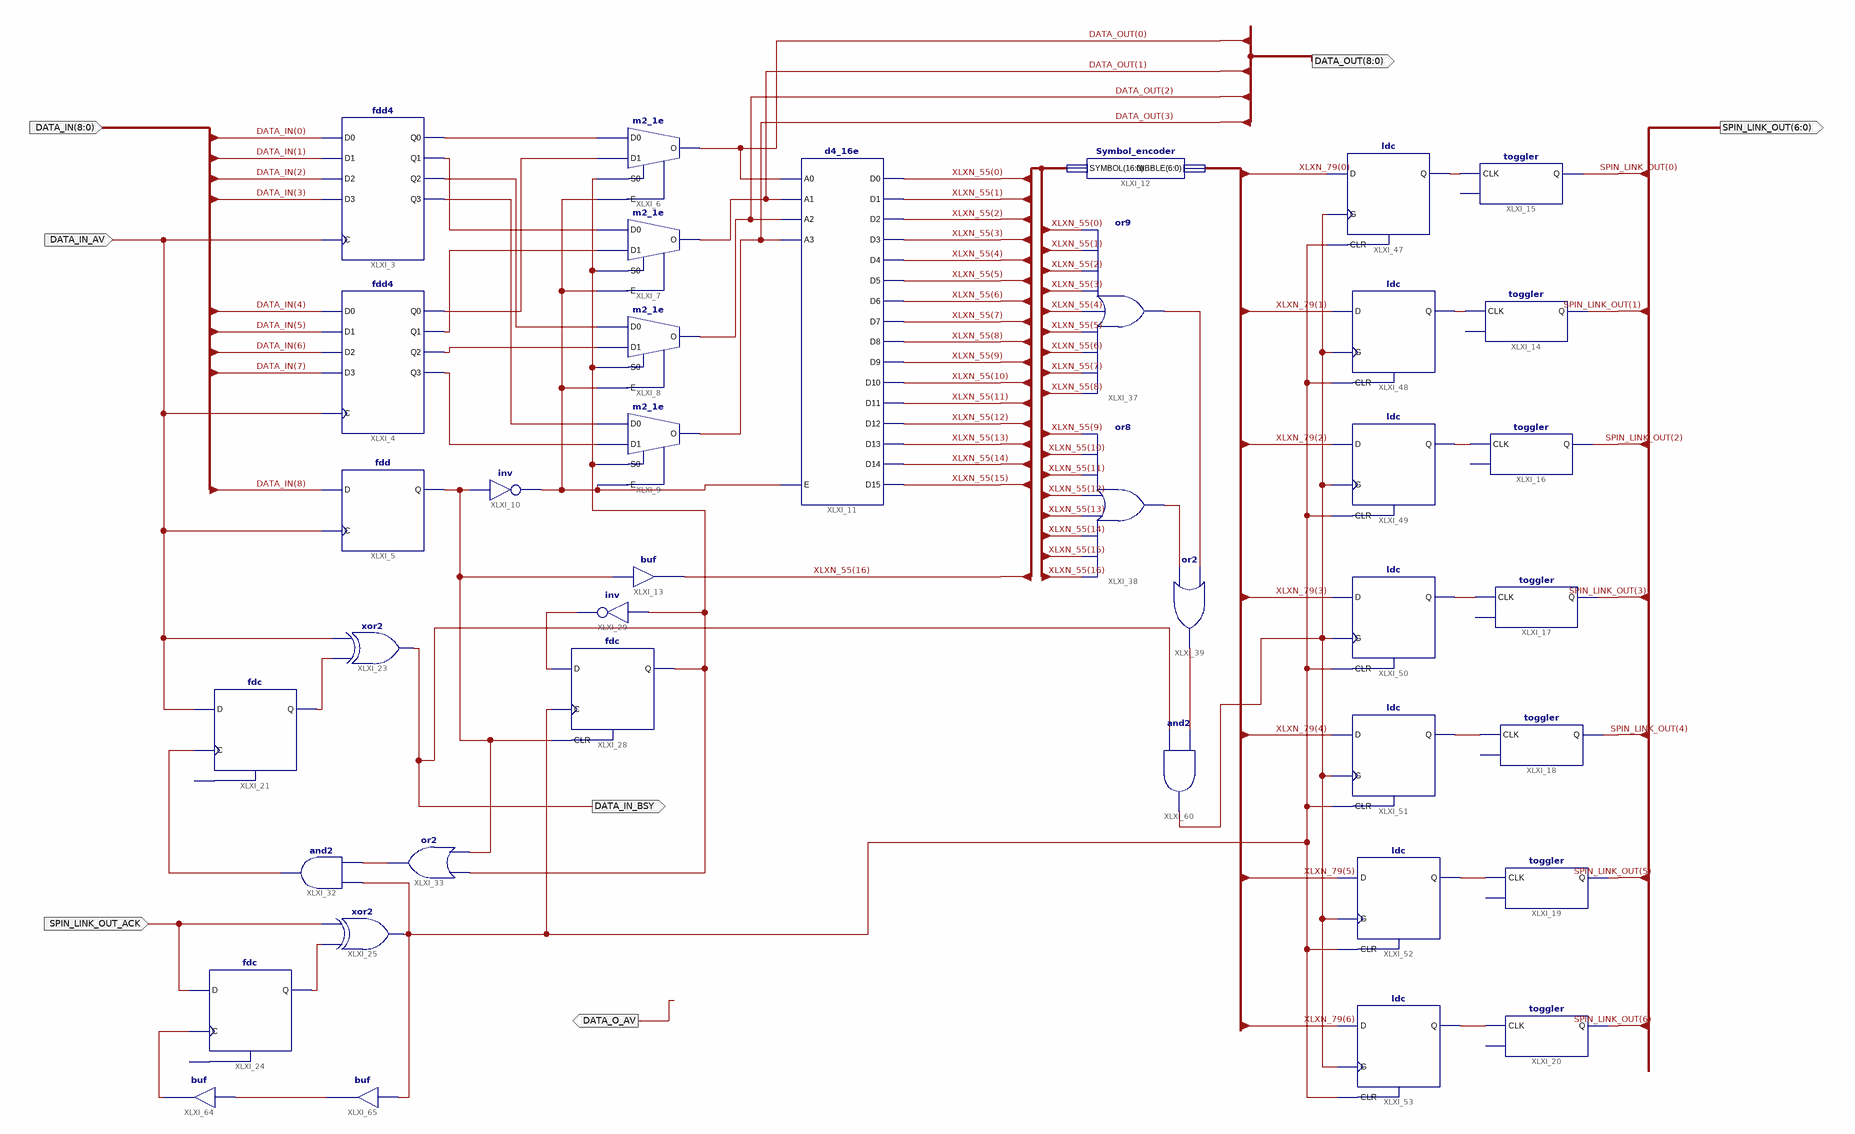
[diagram p0: schematic sheet 1]
// Xilinx ISE schematic Spin_link_output.sch (xbr) as structural Verilog: 39 symbols, 7 ports
module Spin_link_output (
  input  [8:0] DATA_IN,
  input  DATA_IN_AV,
  input  SPIN_LINK_OUT_ACK,
  output DATA_IN_BSY,
  output [6:0] SPIN_LINK_OUT,
  output DATA_O_AV,
  output [8:0] DATA_OUT
);

  wire XLXN_27, XLXN_28, XLXN_29, XLXN_30, XLXN_31, XLXN_32, XLXN_33, XLXN_34, XLXN_43, XLXN_56, XLXN_104,
       XLXN_118, XLXN_148, XLXN_161, XLXN_183, XLXN_184, XLXN_200, XLXN_203, XLXN_228, XLXN_229, XLXN_230,
       XLXN_231, XLXN_232, XLXN_233, XLXN_234, XLXN_258, XLXN_268, XLXN_289, XLXN_290, XLXN_298;
  wire [6:0] XLXN_79;
  wire [16:0] XLXN_55;

  fdd4 XLXI_3 (
    .C(DATA_IN_AV), .D0(DATA_IN[0]), .D1(DATA_IN[1]), .D2(DATA_IN[2]), .D3(DATA_IN[3]), .Q0(XLXN_27),
    .Q1(XLXN_29), .Q2(XLXN_31), .Q3(XLXN_33));
  fdd4 XLXI_4 (
    .C(DATA_IN_AV), .D0(DATA_IN[4]), .D1(DATA_IN[5]), .D2(DATA_IN[6]), .D3(DATA_IN[7]), .Q0(XLXN_28),
    .Q1(XLXN_30), .Q2(XLXN_32), .Q3(XLXN_34));
  fdd XLXI_5 (.C(DATA_IN_AV), .D(DATA_IN[8]), .Q(XLXN_56));
  m2_1e XLXI_6 (.D0(XLXN_27), .D1(XLXN_28), .E(XLXN_43), .S0(XLXN_200), .O(DATA_OUT[0]));
  m2_1e XLXI_7 (.D0(XLXN_29), .D1(XLXN_30), .E(XLXN_43), .S0(XLXN_200), .O(DATA_OUT[1]));
  m2_1e XLXI_8 (.D0(XLXN_31), .D1(XLXN_32), .E(XLXN_43), .S0(XLXN_200), .O(DATA_OUT[2]));
  m2_1e XLXI_9 (.D0(XLXN_33), .D1(XLXN_34), .E(XLXN_43), .S0(XLXN_200), .O(DATA_OUT[3]));
  not XLXI_10 (XLXN_43, XLXN_56);
  d4_16e XLXI_11 (
    .A0(DATA_OUT[0]), .A1(DATA_OUT[1]), .A2(DATA_OUT[2]), .A3(DATA_OUT[3]), .E(XLXN_43), .D0(XLXN_55[0]),
    .D1(XLXN_55[1]), .D10(XLXN_55[10]), .D11(XLXN_55[11]), .D12(XLXN_55[12]), .D13(XLXN_55[13]),
    .D14(XLXN_55[14]), .D15(XLXN_55[15]), .D2(XLXN_55[2]), .D3(XLXN_55[3]), .D4(XLXN_55[4]), .D5(XLXN_55[5]),
    .D6(XLXN_55[6]), .D7(XLXN_55[7]), .D8(XLXN_55[8]), .D9(XLXN_55[9]));
  Symbol_encoder XLXI_12 (.SYMBOL(XLXN_55), .NIBBLE(XLXN_79));
  buf XLXI_13 (XLXN_55[16], XLXN_56);
  fdc XLXI_21 (.C(XLXN_203), .D(DATA_IN_AV), .Q(XLXN_104));  // open: CLR
  xor XLXI_23 (DATA_IN_BSY, XLXN_104, DATA_IN_AV);
  fdc XLXI_28 (.C(XLXN_290), .CLR(XLXN_56), .D(XLXN_148), .Q(XLXN_200));
  not XLXI_29 (XLXN_148, XLXN_200);
  fdc XLXI_24 (.C(XLXN_298), .D(SPIN_LINK_OUT_ACK), .Q(XLXN_118));  // open: CLR
  xor XLXI_25 (XLXN_290, XLXN_118, SPIN_LINK_OUT_ACK);
  or XLXI_37 (XLXN_184, XLXN_55[8], XLXN_55[7], XLXN_55[6], XLXN_55[5], XLXN_55[4], XLXN_55[3], XLXN_55[2], XLXN_55[1], XLXN_55[0]);
  or XLXI_38 (XLXN_183, XLXN_55[16], XLXN_55[15], XLXN_55[14], XLXN_55[13], XLXN_55[12], XLXN_55[11], XLXN_55[10], XLXN_55[9]);
  or XLXI_39 (XLXN_258, XLXN_183, XLXN_184);
  toggler XLXI_14 (.CLK(XLXN_229), .Q(SPIN_LINK_OUT[1]));  // open: CLR
  toggler XLXI_15 (.CLK(XLXN_228), .Q(SPIN_LINK_OUT[0]));  // open: CLR
  ldc XLXI_47 (.G(XLXN_268), .CLR(XLXN_290), .D(XLXN_79[0]), .Q(XLXN_228));
  ldc XLXI_48 (.G(XLXN_268), .CLR(XLXN_290), .D(XLXN_79[1]), .Q(XLXN_229));
  ldc XLXI_49 (.G(XLXN_268), .CLR(XLXN_290), .D(XLXN_79[2]), .Q(XLXN_230));
  ldc XLXI_50 (.G(XLXN_268), .CLR(XLXN_290), .D(XLXN_79[3]), .Q(XLXN_231));
  ldc XLXI_51 (.G(XLXN_268), .CLR(XLXN_290), .D(XLXN_79[4]), .Q(XLXN_232));
  ldc XLXI_52 (.G(XLXN_268), .CLR(XLXN_290), .D(XLXN_79[5]), .Q(XLXN_233));
  ldc XLXI_53 (.G(XLXN_268), .CLR(XLXN_290), .D(XLXN_79[6]), .Q(XLXN_234));
  toggler XLXI_16 (.CLK(XLXN_230), .Q(SPIN_LINK_OUT[2]));  // open: CLR
  toggler XLXI_17 (.CLK(XLXN_231), .Q(SPIN_LINK_OUT[3]));  // open: CLR
  toggler XLXI_18 (.CLK(XLXN_232), .Q(SPIN_LINK_OUT[4]));  // open: CLR
  toggler XLXI_19 (.CLK(XLXN_233), .Q(SPIN_LINK_OUT[5]));  // open: CLR
  toggler XLXI_20 (.CLK(XLXN_234), .Q(SPIN_LINK_OUT[6]));  // open: CLR
  and XLXI_60 (XLXN_268, DATA_IN_BSY, XLXN_258);
  buf XLXI_64 (XLXN_298, XLXN_289);
  buf XLXI_65 (XLXN_289, XLXN_290);
  or XLXI_33 (XLXN_161, XLXN_56, XLXN_200);
  and XLXI_32 (XLXN_203, XLXN_290, XLXN_161);
endmodule
